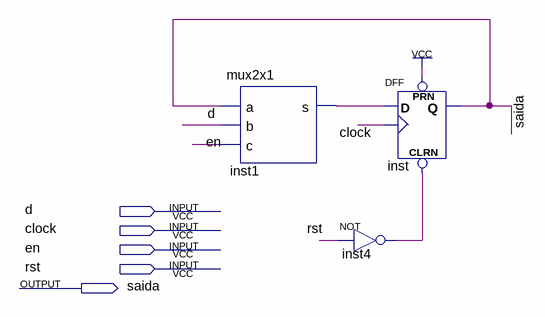
[diagram p0: schematic sheet]
// Quartus schematic reg1bt.bdf as structural Verilog: 3 symbols, 5 pins
module reg1bt (
  input  d,
  input  clock,
  input  en,
  input  rst,
  output saida
);

  wire inst1_s, inst4_out;

  mux2x1 inst1 (.a(saida), .b(d), .c(en), .s(inst1_s));
  not inst4 (inst4_out, rst);
  DFF inst (.CLRN(inst4_out), .CLK(clock), .D(inst1_s), .PRN(1'b1), .Q(saida));
endmodule
